# EAGLE design Receiver_Can_Control_Module_Teensy_Rev2 (EAGLE 6.5.0)
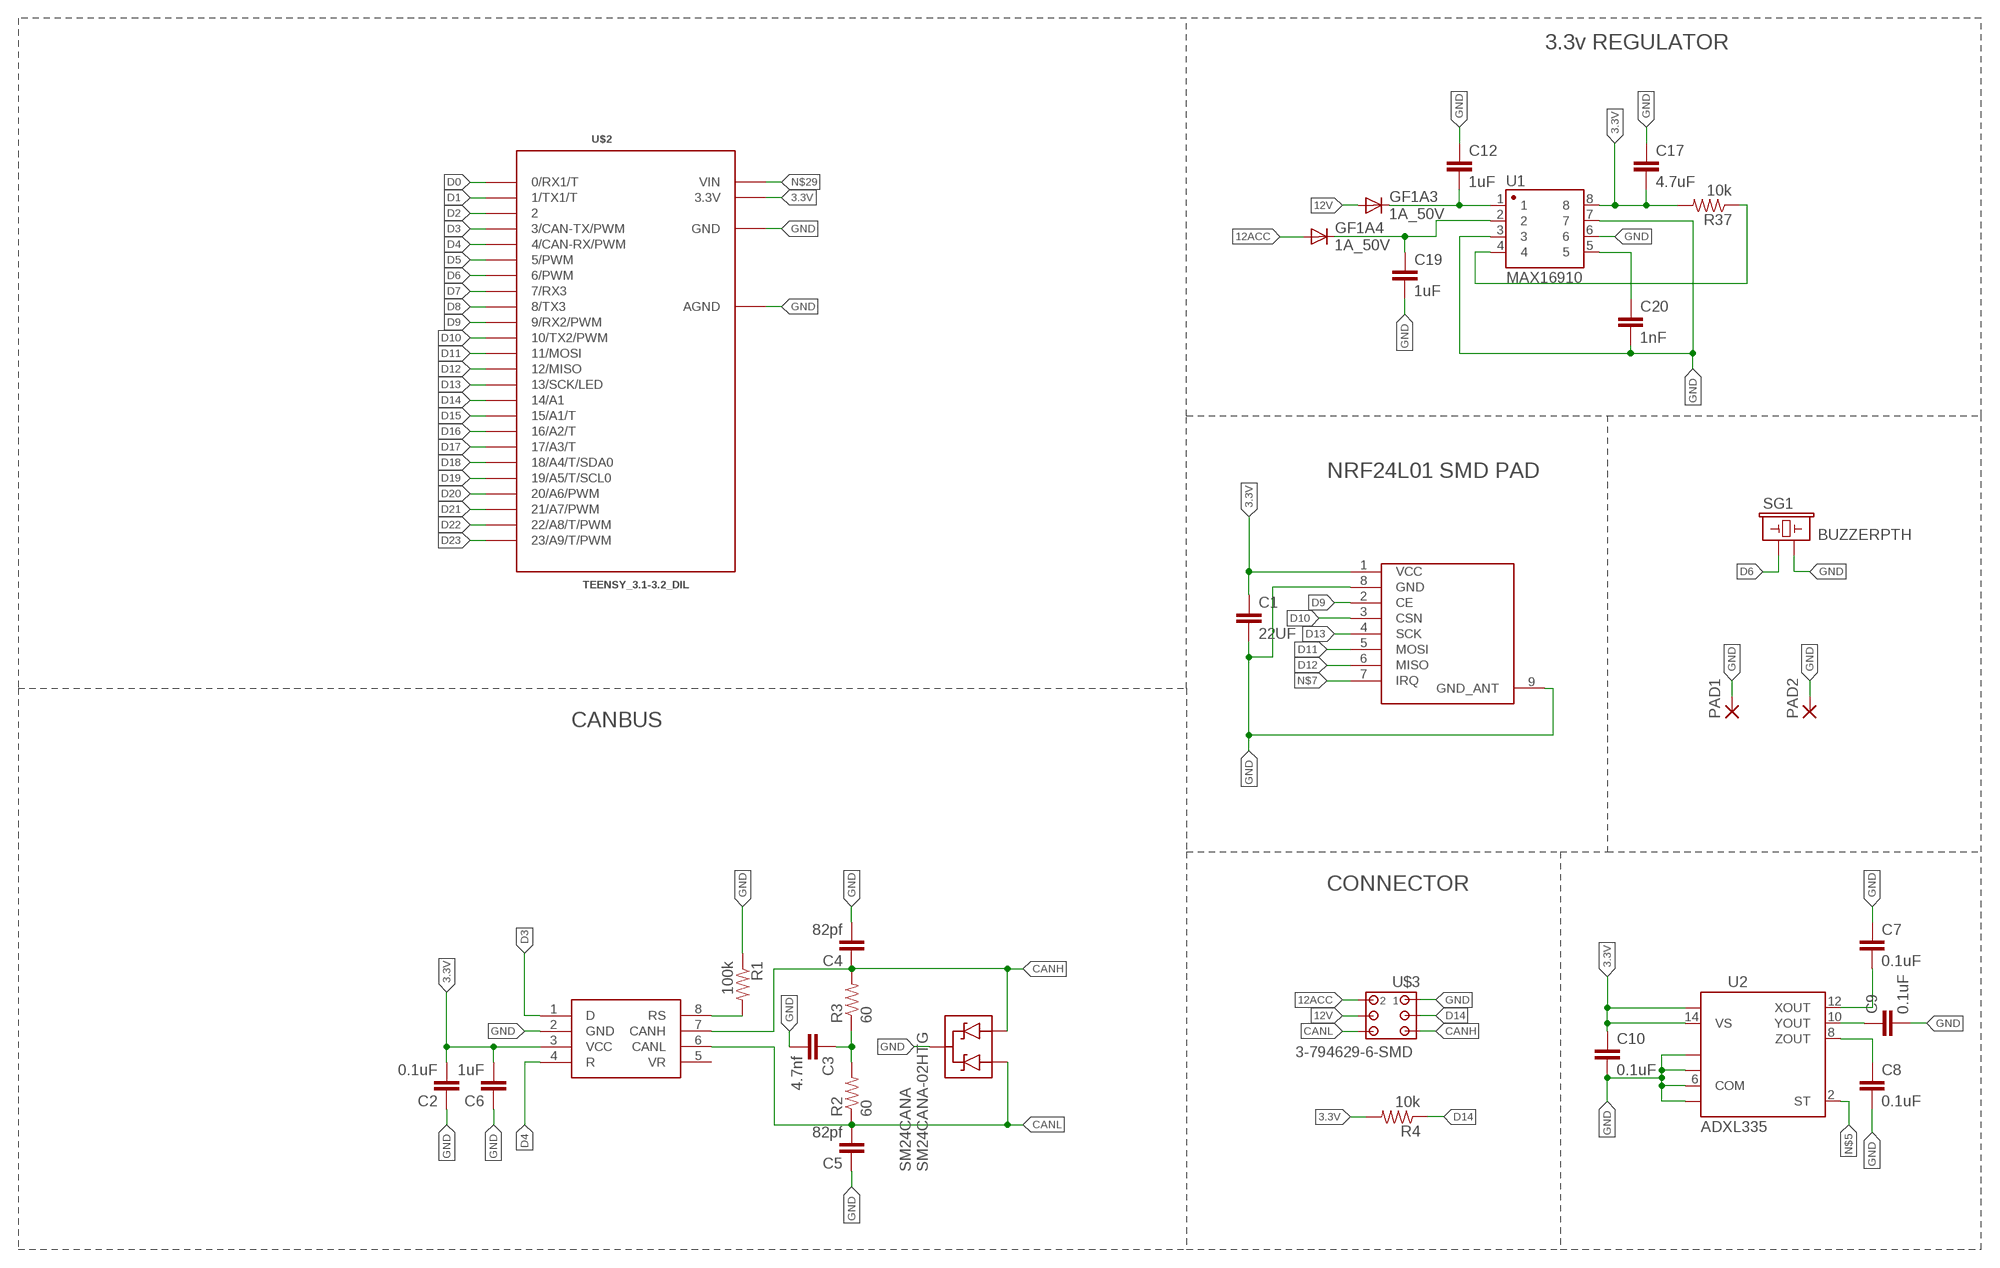
[diagram p0: schematic, sheet 1]

## Parts
C1  22UF  CAP1206  [1206]
C2  0.1uF  CAP0603-CAP  [0603-CAP]
C3  4.7nf  CAP0603-CAP  [0603-CAP]
C4  82pf  CAP0603-CAP  [0603-CAP]
C5  82pf  CAP0603-CAP  [0603-CAP]
C6  1uF  CAP0603-CAP  [0603-CAP]
C7  0.1uF  CAP0603-CAP  [0603-CAP]
C8  0.1uF  CAP0603-CAP  [0603-CAP]
C9  0.1uF  CAP0603-CAP  [0603-CAP]
C10  0.1uF  CAP0603-CAP  [0603-CAP]
C12  1uF  CAP0805  [0805]
C17  4.7uF  CAP0805  [0805]
C19  1uF  CAP0805  [0805]
C20  1nF  CAP0805  [0805]
GF1A3  1A_50V  DIODE-DO-214AC  [DO-214AC]
GF1A4  1A_50V  DIODE-DO-214AC  [DO-214AC]
PAD1  SMD2  [SMD1,27-2,54]
PAD2  SMD2  [SMD1,27-2,54]
R1  100k  R-US_R0402  [R0402]
R2  60  R-US_R0402  [R0402]
R3  60  R-US_R0402  [R0402]
R4  10k  RESISTOR0603-RES  [0603-RES]
R37  10k  RESISTOR0603-RES  [0603-RES]
SG1  BUZZERPTH  [BUZZER-12MM]
SM24CANA  SM24CANA-02HTG  MMBZ27VCLT1  [SOT23-3]
U1  MAX16910  GENERIC-SOIC8MSGEQ7N-FILTER  [SO08]
U2  ADXL335  [LFCSP-16]
U$1  NRF24L01_PAD2  [NRF24-2]
U$2  TEENSY_3.1-3.2_DIL  [TEENSY_3.0-3.2&LC_DIL]
U$3  3-794629-6-SMD  [3-794629-6]
VP230  UP230  SN65HVD230  [SO08]

## Nets
3.3V: C1.1 C2.2 C6.2 C10.1 C17.2 R4.2 R37.2 U1.8 U2.14(VS) U2.15(VS) U$1.1(VCC) U$2.3.3V VP230.3(VCC)
12ACC: GF1A4.A U$3.2
12V: GF1A3.A U$3.4
CANH: C4.1 R3.2 SM24CANA.2(A2) U$3.5 VP230.7(CANH)
CANL: C5.2 R2.1 SM24CANA.1(A1) U$3.6 VP230.6(CANL)
D0: U$2.0(0/RX1/T)
D1: U$2.1(1/TX1/T)
D2: U$2.2
D3: U$2.3(3/CAN-TX/PWM) VP230.1(D)
D4: U$2.4(4/CAN-RX/PWM) VP230.4(R)
D5: U$2.5(5/PWM)
D6: SG1.+ U$2.6(6/PWM)
D7: U$2.7(7/RX3)
D8: U$2.8(8/TX3)
D9: U$1.2(CE) U$2.9(9/RX2/PWM)
D10: U$1.3(CSN) U$2.10(10/TX2/PWM)
D11: U$1.5(MOSI) U$2.11(11/MOSI)
D12: U$1.6(MISO) U$2.12(12/MISO)
D13: U$1.4(SCK) U$2.13(13/SCK/LED)
D14: R4.1 U$2.14/A0(14/A1) U$3.3
D15: U$2.15/A1(15/A1/T)
D16: U$2.16/A2(16/A2/T)
D17: U$2.17/A3(17/A3/T)
D18: U$2.18/A4(18/A4/T/SDA0)
D19: U$2.19/A5(19/A5/T/SCL0)
D20: U$2.20/A6(20/A6/PWM)
D21: C7.2 U2.12(XOUT) U$2.21/A7(21/A7/PWM)
D22: C9.1 U2.10(YOUT) U$2.22/A8(22/A8/T/PWM)
D23: C8.1 U2.8(ZOUT) U$2.23/A9(23/A9/T/PWM)
GND: C1.2 C2.1 C3.2 C4.2 C5.1 C6.1 C7.1 C8.2 C9.2 C10.2 C12.1 C17.1 C19.2 C20.2 PAD1.1(P) PAD2.1(P) R1.1 SG1.- SM24CANA.3(C) U1.3 U1.6 U1.7 U2.3(COM) U2.5(COM) U2.6(COM) U2.7(COM) U$1.8(GND) U$1.9(GND_ANT) U$2.AGND U$2.GND U$3.1 VP230.2(GND)
N$4: C12.2 GF1A3.C U1.1
N$5: U2.2(ST)
N$7: U$1.7(IRQ)
N$12: C19.1 GF1A4.C U1.2
N$29: U$2.VIN
N$30: R37.1 U1.4
N$34: C20.1 U1.5
N$52: R1.2 VP230.8(RS)
N$56: C3.1 R2.2 R3.1
Unconnected: VP230.5(VR)

## Notes on the sheet
- 3.3v REGULATOR
- NRF24L01 SMD PAD
- CANBUS
- CONNECTOR

## Library data of the parts
C1 = SparkFun:CAP: Capacitor Standard 0603 ceramic capacitor, and 0.1" leaded capacitor.
C2-C10 C12 C17 C19 C20 = SparkFun-Capacitors:CAP: Capacitor Standard 0603 ceramic capacitor, and 0.1" leaded capacitor.
GF1A3 GF1A4 = diode:DIODE-: DIODE
PAD1 PAD2 = wirepad:SMD2: SMD PAD
R1-R3 = resistor:R-US_: RESISTOR, American symbol
R4 R37 = SparkFun:RESISTOR: Resistor Basic schematic elements and footprints for 0603, 1206, and PTH resistors.
SG1 = SparkFun-Electromechanical:BUZZER: Buzzer 12mm Spark Fun Electronics SKU : Comp-Buzzer
SM24CANA = SparkFun-DiscreteSemi:MMBZ27VCLT1: 40W Zener-diode transient voltage suppressor (ESD protection)
U1 = SparkFun-AnalogIC:GENERIC-SOIC8: A placeholder for generic narrow & wide SOIC8 foorptints - used on the DIP adapter board.; PROD_ID: IC-10141
U2 = SparkFun-Sensors:ADXL335: 3-axis, 3g accelerometer, analog out
U$1 = my-library:NRF24L01_PAD2
U$2 = Teensy_3_and_LC_Series_Boards_v1.4:TEENSY_3.1-3.2_DIL: Teensy 3.1 or 3.2 in a DIL Layout.
U$3 = con-amp:3-794629-6-SMD
VP230 = smd-footprints:SN65HVD230

## Net classes
0 default: width 0.203 mm
1 vcc: width 0.254 mm

## Board
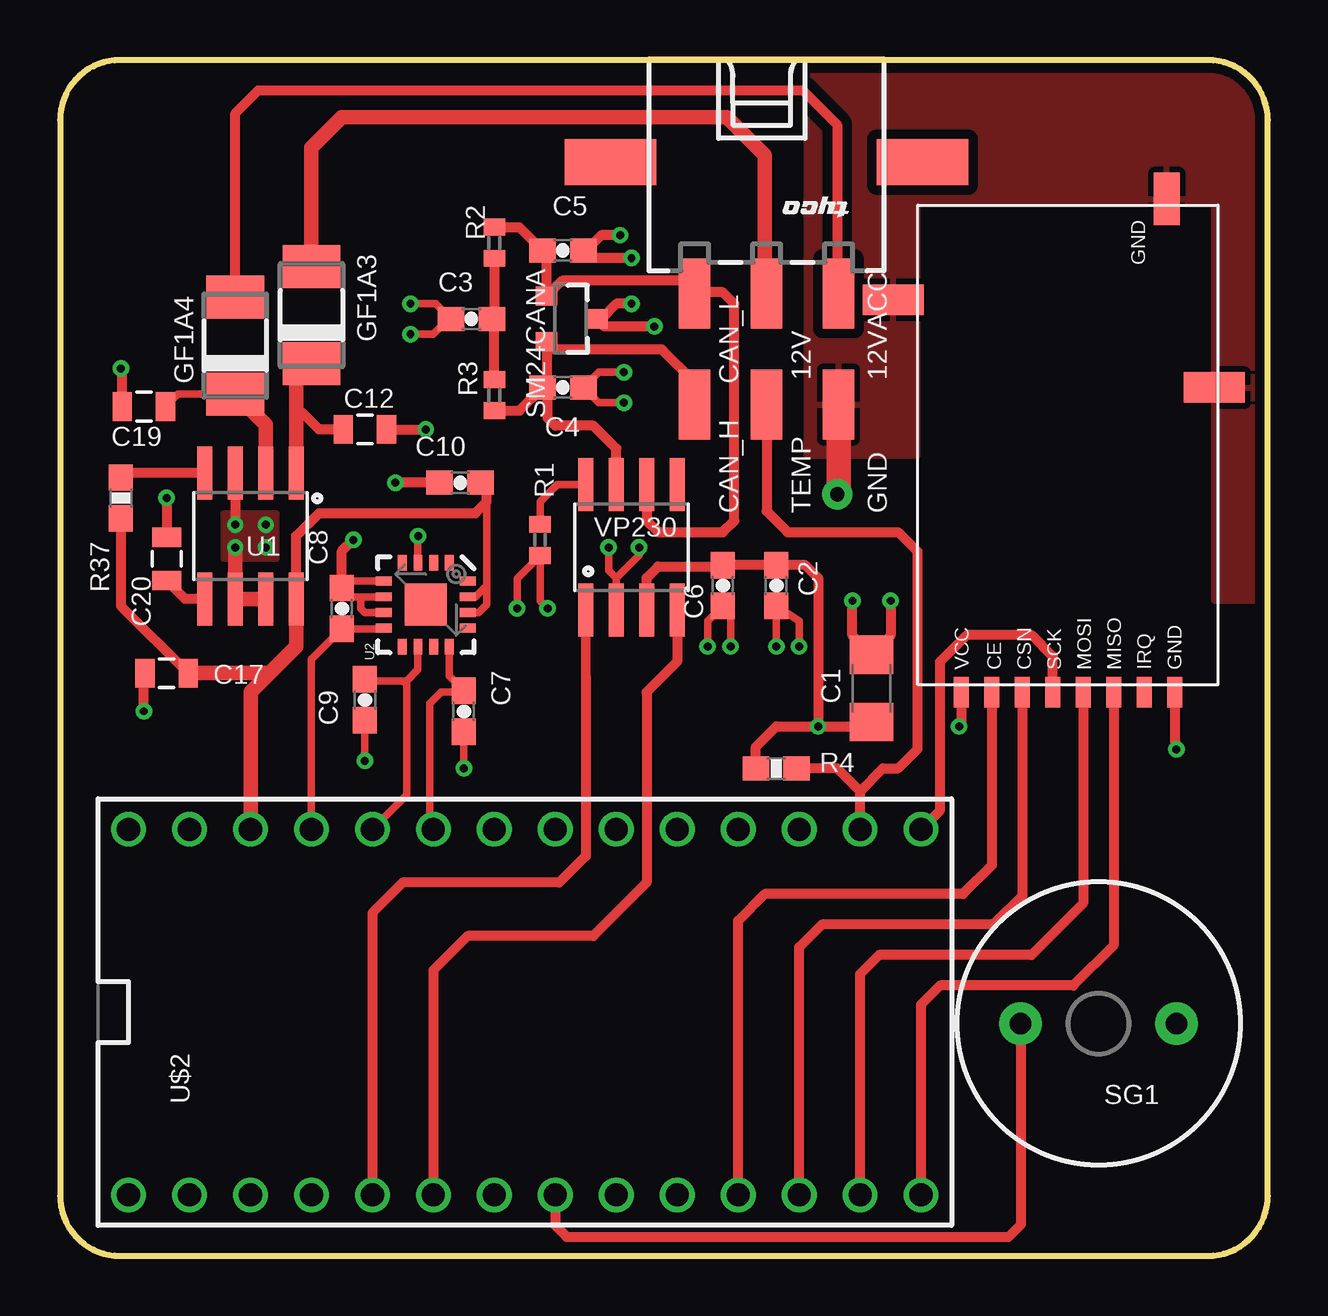
[diagram p1: board, top side]
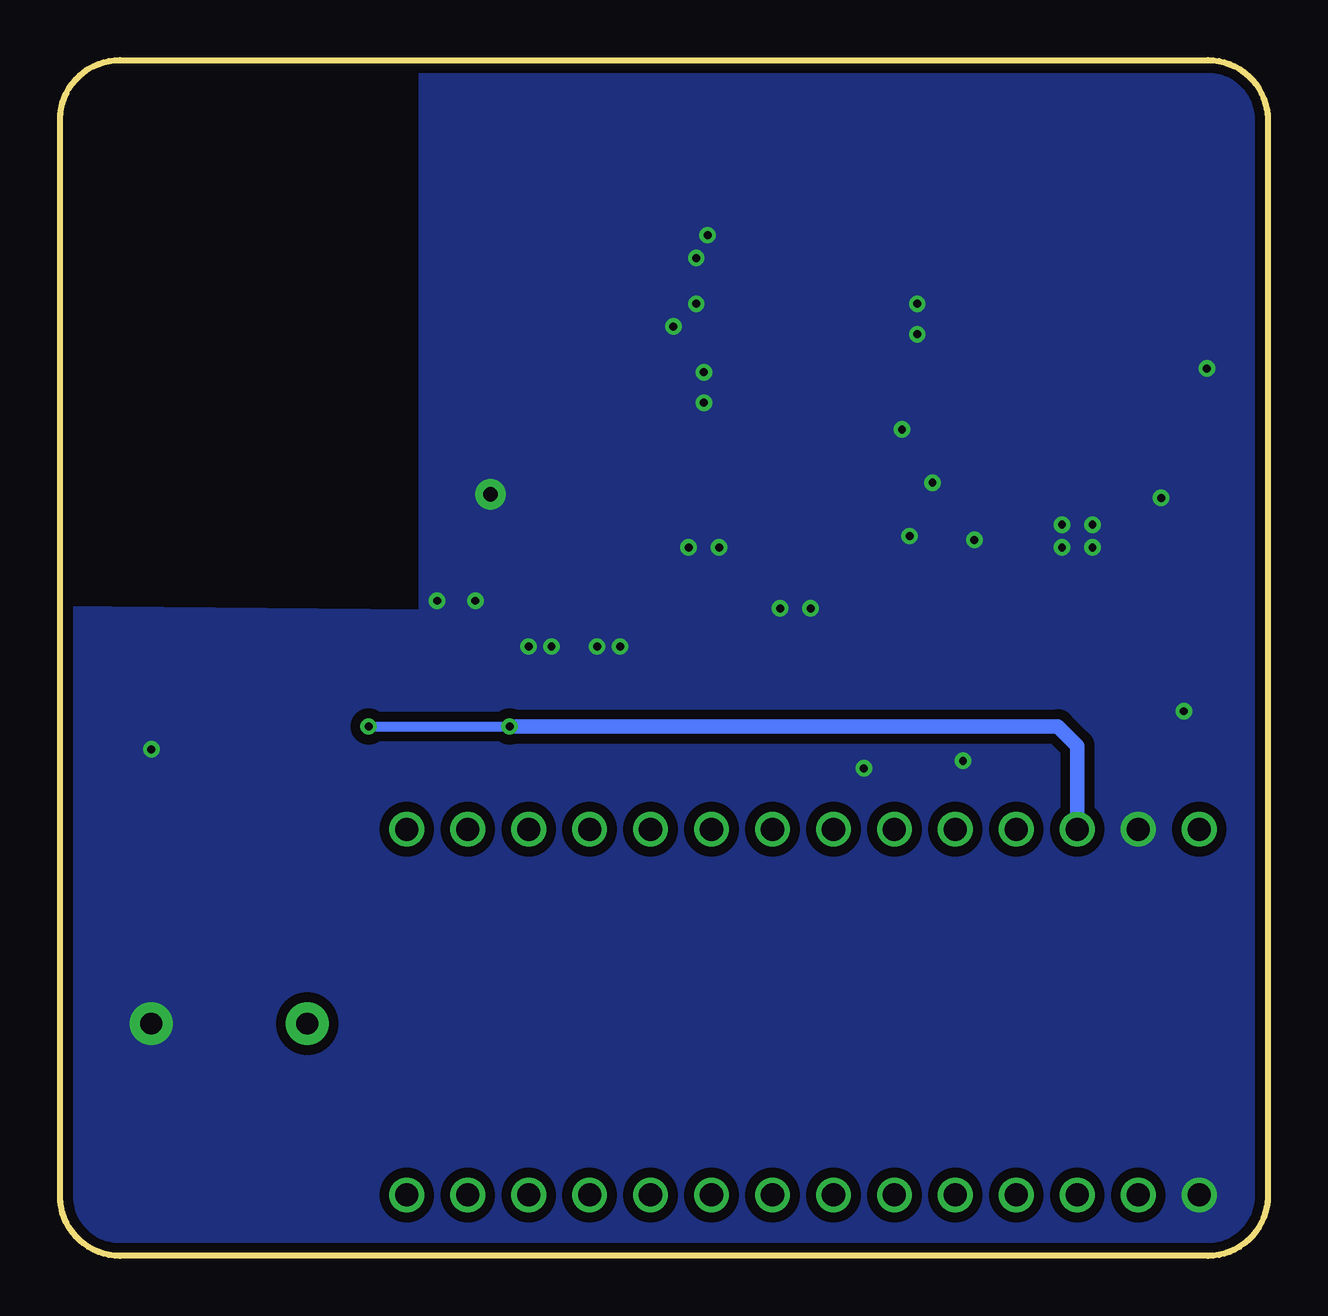
[diagram p2: board, bottom side, seen from below]

Size 50.32 x 49.85 mm. Coordinates in mm from the lower left corner, seen from the top.
Outline: 0,47.35 0,2.5 arc90 2.5,0 47.82,0 arc90 50.32,2.5 50.32,47.35 arc90 47.82,49.85 2.5,49.85 arc90 0,47.35
Copper layers (1*16): Top 0.0356mm / dielectric 1.5011mm / Bottom 0.0356mm
Design rules "oshpark-2layer": minimum track width 6mil, minimum drill 13mil, track to track 6mil, track to pad 6mil, pad to pad 6mil, via to via 6mil, smd to smd 6mil, copper to edge 15mil, drill to drill 6mil, minimum pad ring 7mil, minimum via ring 7mil, stop-mask expansion 2.5mil, vias tented up to drill 0mil, thermal gap 10mil

### Footprints (pad centres in the part's own frame; a part is rotated, then mirrored left to right if it is on the bottom)
1206 = smd 1.6 x 1.8: 1 -1.4,0; 2 1.4,0
0603-CAP = smd 1.1 x 1: 1 -0.85,0; 2 0.85,0
0805 = smd 0.8 x 1.2: 1 -0.9,0; 2 0.9,0
DO-214AC = smd 1.8 x 2.4: A 2.025,0; C -2.025,0
SMD1,27-2,54 = smd 1.27 x 2.54: 1 0,0
R0402 = smd 0.7 x 0.9: 1 -0.65,0; 2 0.65,0
0603-RES = smd 1.1 x 1: 1 -0.85,0; 2 0.85,0
BUZZER-12MM = drill 0.9 pad 1.778: + 3.25,0; - -3.25,0
SOT23-3 = smd 0.8 x 0.9: 1 -0.95,-1; 2 0.95,-1; 3 0,1.1
SO08 = smd 0.61 x 2.21: 1 -1.905,-2.616; 2 -0.635,-2.616; 3 0.635,-2.616; 4 1.905,-2.616; 5 1.905,2.616; 6 0.635,2.616; 7 -0.635,2.616; 8 -1.905,2.616
LFCSP-16 = smd 1.75 x 1.75: 0 0,0 | smd 0.65 x 0.37: 1 -1.75,0.975; 2 -1.75,0.325; 3 -1.75,-0.325; 4 -1.75,-0.975; 9 1.75,-0.975; 10 1.75,-0.325; 11 1.75,0.325; 12 1.75,0.975 | smd 0.37 x 0.65: 5 -0.975,-1.75; 6 -0.325,-1.75; 7 0.325,-1.75; 8 0.975,-1.75; 13 0.975,1.75; 14 0.325,1.75; 15 -0.325,1.75; 16 -0.975,1.75
NRF24-2 = smd 1.27 x 0.635: 1 -11.43,3.81; 2 -11.43,2.54; 3 -11.43,1.27; 4 -11.43,0; 5 -11.43,-1.27; 6 -11.43,-2.54; 7 -11.43,-3.81; 8 -11.43,-5.08 | smd 2.184 x 1.067: 9 9.13,-4.75
TEENSY_3.0-3.2&LC_DIL = drill 0.965: 0 -7.62,13.97; 1 -7.62,11.43; 2 -7.62,8.89; 3 -7.62,6.35; 3.3V 7.62,11.43; 4 -7.62,3.81; 5 -7.62,1.27; 6 -7.62,-1.27; 7 -7.62,-3.81; 8 -7.62,-6.35; 9 -7.62,-8.89; 10 -7.62,-11.43; 11 -7.62,-13.97; 12 -7.62,-16.51; 13 7.62,-16.51; 14/A0 7.62,-13.97; 15/A1 7.62,-11.43; 16/A2 7.62,-8.89; 17/A3 7.62,-6.35; 18/A4 7.62,-3.81; 19/A5 7.62,-1.27; 20/A6 7.62,1.27; 21/A7 7.62,3.81; 22/A8 7.62,6.35; 23/A9 7.62,8.89; AGND 7.62,13.97; GND -7.62,16.51; VIN 7.62,16.51
3-794629-6 = smd 1.3 x 2.92: 1 -3.23,9.6; 2 -3.23,4.98; 3 -0.23,9.6; 4 -0.23,4.98; 5 2.77,9.6; 6 2.77,4.98 | smd 3.81 x 1.93: P$1 -6.73,-0.5; P$2 6.27,-0.5

### Placement (x,y rotation side)
C1  33.81,23.65 90 top
C2  29.84,27.94 90 top
C3  17.14,39.05 180 top
C4  20.95,36.2 0 top
C5  20.95,41.91 180 top
C6  27.62,27.94 90 top
C7  16.83,22.7 90 top
C8  11.75,26.99 90 top
C9  12.7,23.18 270 top
C10  16.67,32.23 180 top
C12  12.7,34.45 180 top
C17  4.45,24.29 0 top
C19  3.49,35.4 180 top
C20  4.45,29.05 90 top
GF1A3  10.48,39.21 90 top
GF1A4  7.3,37.94 90 top
PAD1  48.1,36.2 90 top
PAD2  34.72,39.85 90 top
R1  20,29.84 90 top
R2  18.1,42.23 270 top
R3  18.1,35.88 270 top
R4  29.84,20.32 180 top
R37  2.54,31.59 270 top
SG1  43.27,9.68 180 top
SM24CANA  21.27,39.05 270 top
U1  7.94,30 180 top
U2  15.24,27.15 270 top
U$1  41.37,34.92 90 top
U$2  19.37,10.16 90 top
U$3  29.21,45.09 180 top
VP230  23.81,29.53 0 top

### Tracks (layer width: path | path; a pad name or v marks a point on that pad's centre or on a via)
3.3V  (via drill 0.33)
  Top 0.305: U2.15 17.31,27.47 17.78,27.94 | U2.14 17.45,26.82 17.78,27.15 17.78,27.94 | 17.78,27.94 17.78,31.59
  Top 0.406: U1.8 9.84,30 10.79,30.96 17.3,30.96 17.78,31.43 17.78,31.59 17.78,31.96 C10.1 | R37.2 2.54,27.09 C17.2 | VP230.3 24.45,28.26 24.92,28.73 27.57,28.73 C6.2 C2.2 31.06,28.79 31.59,28.26 v31.59,22.07 | R4.2 29,21.22 29.84,22.07 v31.59,22.07 | 33.97,22.07 33.81,22.23 C1.1 33.63,22.07 v31.59,22.07 | U$1.1 37.55,22.16 v37.47,22.07
  Top 0.61: U1.8 9.84,25.4 9.05,24.61 8.73,24.29 | 8.73,24.29 C17.2 | U$2.3.3V 7.94,23.5 8.73,24.29
  Bottom 0.406: v37.47,22.07 v31.59,22.07
  Bottom 0.61: v31.59,22.07 8.74,22.07 7.94,21.26 U$2.3.3V
12ACC
  Top 0.406: GF1A4.A 7.3,47.62 8.26,48.58 30.96,48.58 32.38,47.15 32.38,40.16 U$3.2
12V
  Top 0.61: GF1A3.A 10.48,46.2 11.75,47.47 27.78,47.47 29.37,45.88 29.37,40.18 U$3.4
CANH
  Top 0.406: R3.2 19.14,35.23 C4.1 | C4.1 20.27,36.36 SM24CANA.2 20.59,37.78 25.08,37.78 26.44,36.42 U$3.5 | VP230.7 23.18,33.66 22.23,34.61 20.64,34.61 20.32,34.92 20.32,35.98 C4.1
CANL
  Top 0.305: 20.32,41.7 C5.2
  Top 0.406: R2.1 19.14,42.88 C5.2 20.27,41.74 SM24CANA.1 20.91,40.64 25.91,40.64 U$3.6 | U$3.6 26.22,40.32 | VP230.6 24.45,30.64 24.92,30.16 27.62,30.16 28.1,30.64 28.1,39.69 27.62,40.16 26.5,40.16 U$3.6
D3
  Top 0.404: 21.91,24.13 VP230.1
  Top 0.406: 21.91,24.13 21.91,16.67 20.8,15.56 14.29,15.56 13.02,14.29 U$2.3
D4
  Top 0.406: U$2.4 15.56,11.91 16.99,13.34 22.23,13.34 24.45,15.56 24.45,23.5 25.72,24.77 VP230.4
D6
  Top 0.406: U$2.6 20.64,1.27 21.11,0.79 39.53,0.79 40.02,1.29 SG1.+
D9
  Top 0.406: U$2.9 28.26,13.97 29.37,15.08 37.62,15.08 38.83,16.28 U$1.2
D10
  Top 0.406: U$2.10 30.8,12.86 31.75,13.81 38.89,13.81 40.09,15.01 U$1.3
D11
  Top 0.406: U$2.11 33.34,11.75 34.13,12.54 40.48,12.54 42.63,14.7 U$1.5
D12
  Top 0.406: U$2.12 35.88,10.48 36.67,11.27 42.23,11.27 43.91,12.95 U$1.6
D13
  Top 0.406: U$2.13 36.67,18.57 36.67,24.77 37.78,25.88 40.48,25.88 41.37,24.99 U$1.4
D14
  Top 0.406: U$2.14/A0 33.34,19.37 | 33.34,19.37 32.38,20.32 R4.1 | U$3.3 29.44,31.04 30.32,30.16 34.92,30.16 35.72,29.37 35.72,21.11 34.92,20.32 34.29,20.32 33.34,19.37
D21
  Top 0.305: U2.12 16.21,24.16 C7.2 16.77,23.5 15.88,23.5 15.4,23.02 15.4,17.94 U$2.21/A7
D22
  Top 0.305: U2.10 14.91,24.44 14.45,23.97 14.29,23.97 | 14.29,23.97 12.76,23.97 C9.1 | 14.29,23.97 14.45,23.81 14.45,19.21 U$2.22/A8
D23
  Top 0.305: U2.8 13.46,26.14 C8.1 10.48,24.87 U$2.23/A9
GND  (via drill 0.33, 0.6 pad 1.27)
  Top 0.305: VP230.2 23.18,28.26 | 23.18,28.26 22.86,28.57 v22.86,29.53 | v24.13,29.53 24.13,29.21 23.18,28.26 | v14.61,38.42 15.56,38.42 16.19,39.05 C3.2 15.66,39.69 v14.61,39.69 | v23.5,36.83 22.44,36.83 C4.2 22.44,35.56 v23.5,35.56 | v26.99,25.4 26.99,26.45 C6.1 27.94,26.77 v27.94,25.4 | v20.32,26.99 20,27.3 R1.1 19.05,28.24 v19.05,26.99 | v30.8,25.4 30.8,26.45 C2.1 v29.84,25.4 | U2.5 12.03,28.12 C8.2 12.11,27.47 12.54,27.47 | U2.6 12.54,27.47 | U2.7 12.71,26.82 12.54,26.99 12.54,27.47 | C9.2 v12.7,20.64 | U2.3 v14.91,30 v14.92,30 | C7.1 v16.83,20.32
  Top 0.406: v4.45,31.59 C20.2 | 16.51,38.84 C3.2 | v24.77,38.73 22.69,38.73 SM24CANA.3 22.54,39.05 23.18,39.69 v23.81,39.69 | v23.81,41.59 22.12,41.59 C5.1 | v23.34,42.55 22.54,42.55 21.91,41.91 | U1.3 v7.3,30.48 | C12.1 v15.24,34.45 | C19.2 2.59,36.94 v2.54,36.99 | v34.61,27.3 34.61,25.85 C1.2 33.02,25.85 v33.02,27.3 | C8.2 11.75,29.37 v12.22,29.84 | v3.49,22.7 3.49,24.24 C17.1 | C10.2 v13.97,32.23 | U$1.8 46.45,21.18 v46.51,21.11
  Top 0.61: U1.7 U1.6 v7.3,29.53
  Top 0.813: 32.52,35.56 U$3.1
  Top 1.016: U$3.1 32.44,31.8 v32.38,31.75
  other vias: 8.57,30.48 8.57,29.53
  pour Bottom (isolate 0.406, no thermals): 0,0 50.32,0 50.32,26.99 35.24,26.83 35.24,49.85 0,49.85
  pour Top: 6.82,30.96 9.02,30.96 9.02,29.05 6.82,29.05
  pour Top (isolate 0.406): 31.11,49.85 50.32,49.85 50.32,27.3 48.1,27.3 48.1,43.81 35.72,43.81 35.72,33.34 31.11,33.34
N$4
  Top 0.406: C12.2 10.79,34.45 9.84,35.4
  Top 0.61: U1.1 9.84,35.4 9.84,36.55 GF1A3.C
N$12
  Top 0.305: GF1A4.C 4.91,35.92 C19.1
  Top 0.61: U1.2 8.57,34.65 GF1A4.C
N$30
  Top 0.305: 2.72,32.62 R37.1
  Top 0.406: U1.4 2.72,32.62
N$34
  Top 0.406: U1.5 5.21,27.39 C20.1
N$52
  Top 0.305: VP230.8 20.71,32.14 20,31.43 R1.2
N$56
  Top 0.406: 17.77,39.28 C3.1 | R2.2 18.1,39.16 C3.1 | R3.1 18.1,38.95 C3.1

### Text on the board
tNames: 12V | 12VACC | CAN_L | CAN_H | TEMP | GND